# Altium schematic sheet Power.SchDoc
size A3; SheetNumber: 2; SheetTotal: 3
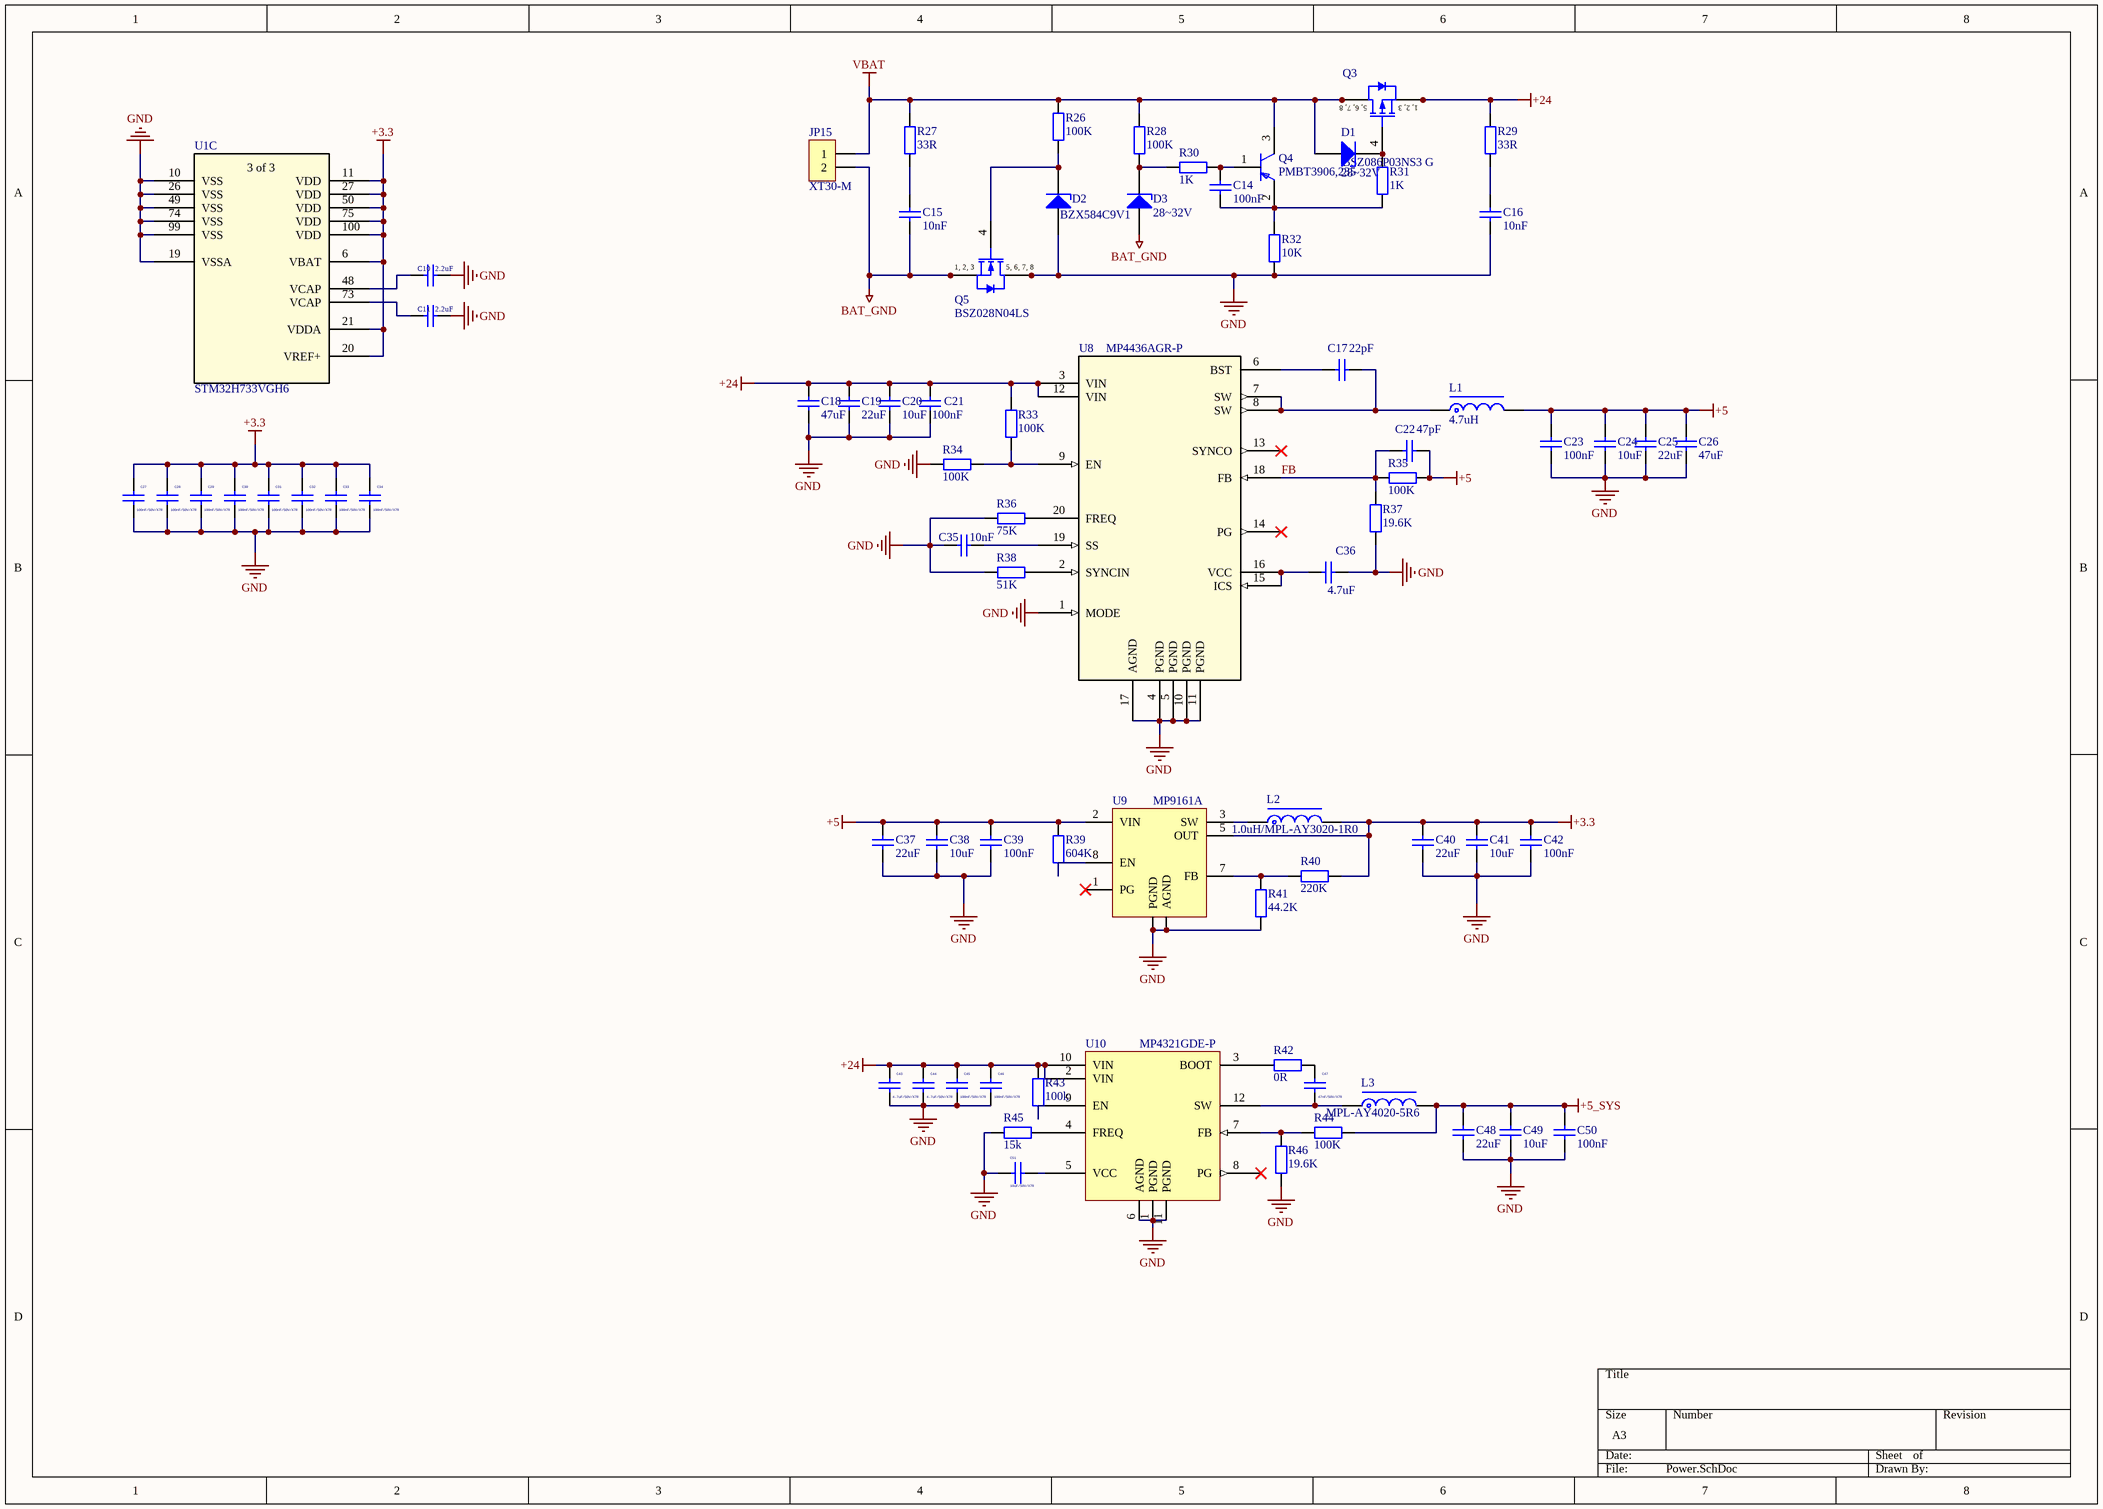
[diagram p0: Power.SchDoc]

## Parts
C10  2.2uF  [C0402_L]
C11  2.2uF  [C0402_L]
C14  100nF  [C0402_M]
C15  10nF  [C0402_M]
C16  10nF  [C0402_M]
C17  22pF  [C0402_M]
C18  47uF  [C1206_L]
C19  22uF  [C0805_L]
C20  10uF  [C0603_L]
C21  100nF  [C0603_L]
C22  47pF  [C0402_M]
C23  100nF  [C0603_L]
C24  10uF  [C0603_L]
C25  22uF  [C0805_L]
C26  47uF  [C1206_L]
C27  100nF/50V/X7R  [C0402_L]
C28  100nF/50V/X7R  [C0402_L]
C29  100nF/50V/X7R  [C0402_L]
C30  100nF/50V/X7R  [C0402_L]
C31  100nF/50V/X7R  [C0402_L]
C32  100nF/50V/X7R  [C0402_L]
C33  100nF/50V/X7R  [C0402_L]
C34  100nF/50V/X7R  [C0402_L]
C35  10nF  [C0402_M]
C36  4.7uF  [C0402_M]
C37  22uF  [C0805_M]
C38  10uF  [C0603_M]
C39  100nF  [C0402_M]
C40  22uF  [C0603_M]
C41  10uF  [C0402_M]
C42  100nF  [C0402_M]
C43  4.7uF/50V/X7R  [C0402_L]
C44  4.7uF/50V/X7R  [C0402_L]
C45  100nF/50V/X7R  [C0402_L]
C46  100nF/50V/X7R  [C0402_L]
C47  47nF/50V/X7R  [C0402_L]
C48  22uF  [C0603_M]
C49  10uF  [C0402_M]
C50  100nF  [C0402_M]
C51  10uF/50V/X7R  [C0402_L]
D1  28~32V  [SOD-523]
D2  BZX584C9V1  [SOD-523]
D3  28~32V  [SOD-523]
JP15  XT30-M  [XT30PW-M]
L1  4.7uH  [MPL-AL6050]
L2  1.0uH/MPL-AY3020-1R0  [MPL-AY3020]
L3  MPL-AY4020-5R6  [MPL-AY4020]
Q3  BSZ086P03NS3 G  [INF-PG-TSDSON-8-1_V]
Q4  PMBT3906,235  [FP-SOT23-IPC_C]
Q5  BSZ028N04LS  [INF-PG-TSDSON-8_FL_V]
R26  100K  [R0402_M]
R27  33R  [R0402_M]
R28  100K  [R0402_M]
R29  33R  [R0402_M]
R30  1K  [R0402_M]
R31  1K  [R0402_M]
R32  10K  [R0402_M]
R33  100K  [R0402_M]
R34  100K  [R0402_M]
R35  100K  [R0402_M]
R36  75K  [R0402_M]
R37  19.6K  [R0402_M]
R38  51K  [R0402_M]
R39  604K  [R0402_L]
R40  220K  [R0402_L]
R41  44.2K  [R0402_L]
R42  0R  [R0402_L]
R43  100k  [R0402_L]
R44  100K  [R0402_L]
R45  15k  [R0402_L]
R46  19.6K  [R0402_L]
U1  STM32H733VGH6  [LQFP100_STM]  (part C of 3)
U8  MP4436AGR-P  [QFN-20_4MMX4MM_MPS]
U9  MP9161A  [SOT23-8]
U10  MP4321GDE-P  [QFN-12_MP4321_MNP]

## Nets
+3.3: C27.2 C28.2 C29.2 C30.2 C31.2 C32.2 C33.2 C34.2 C40.2 C41.2 C42.2 L2.2 R40.2 U1.6(VBAT) U1.11(VDD) U1.20(VREF+) U1.21(VDDA) U1.27(VDD) U1.50(VDD) U1.75(VDD) U1.100(VDD) U9.5(OUT)
+5: C22.2 C23.2 C24.2 C25.2 C26.1 C37.2 C38.2 C39.2 L1.2 R35.2 R39.2 U9.2(VIN)
+5_SYS: C48.2 C49.2 C50.2 L3.2 R44.1
+24: C18.1 C19.1 C20.1 C21.1 C43.2 C44.2 C45.2 C46.2 Q3.1(SOURCE) Q3.2(SOURCE) Q3.3(SOURCE) R29.1 R33.2 R43.2 U8.3(VIN) U8.12(VIN) U10.2(VIN) U10.10(VIN)
BAT_GND: C15.2 D3.1(A) JP15.2 Q5.1(SOURCE) Q5.2(SOURCE) Q5.3(SOURCE)
GND: C10.2 C11.2 C16.2 C18.2 C19.2 C20.2 C21.2 C23.1 C24.1 C25.1 C26.2 C27.1 C28.1 C29.1 C30.1 C31.1 C32.1 C33.1 C34.1 C35.1 C36.1 C37.1 C38.1 C39.1 C40.1 C41.1 C42.1 C43.1 C44.1 C45.1 C46.1 C48.1 C49.1 C50.1 C51.2 D2.1(A) Q5.5(DRAIN) Q5.6(DRAIN) Q5.7(DRAIN) Q5.8(DRAIN) R32.2 R34.2 R36.2 R37.1 R38.2 R41.2 R45.2 R46.2 U1.10(VSS) U1.19(VSSA) U1.26(VSS) U1.49(VSS) U1.74(VSS) U1.99(VSS) U8.1(MODE) U8.4(PGND) U8.5(PGND) U8.10(PGND) U8.11(PGND) U8.17(AGND) U9.4(PGND) U9.6(AGND) U10.1(PGND) U10.6(AGND) U10.11(PGND)
VBAT: D1.1(A) JP15.1 Q3.5(DRAIN) Q3.6(DRAIN) Q3.7(DRAIN) Q3.8(DRAIN) Q4.3(C) R26.2 R27.2 R28.2
FB: C22.1 R35.1 R37.2 U8.18(FB)
NetC10_1: C10.1 U1.48(VCAP)
NetC11_1: C11.1 U1.73(VCAP)
NetC14_1: C14.1 Q4.1(B) R30.1
NetC14_2: C14.2 Q4.2(E) R31.2 R32.1
NetC15_1: C15.1 R27.1
NetC16_1: C16.1 R29.2
NetC17_1: C17.1 U8.6(BST)
NetC17_2: C17.2 L1.1 U8.7(SW) U8.8(SW)
NetC35_2: C35.2 U8.19(SS)
NetC36_2: C36.2 U8.15(ICS) U8.16(VCC)
NetC47_1: C47.1 L3.1 U10.12(SW)
NetC47_2: C47.2 R42.1
NetC51_1: C51.1 U10.5(VCC)
NetD1_2: D1.2(K) Q3.4(GATE) R31.1
NetD2_2: D2.2(K) Q5.4(GATE) R26.1
NetD3_2: D3.2(K) R28.1 R30.2
NetL2_1: L2.1 U9.3(SW)
NetR33_1: R33.1 R34.1 U8.9(EN)
NetR36_1: R36.1 U8.20(FREQ)
NetR38_1: R38.1 U8.2(SYNCIN)
NetR39_1: R39.1 U9.8(EN)
NetR40_1: R40.1 R41.1 U9.7(FB)
NetR42_2: R42.2 U10.3(BOOT)
NetR43_1: R43.1 U10.9(EN)
NetR44_2: R44.2 R46.1 U10.7(FB)
NetR45_1: R45.1 U10.4(FREQ)

Not connected (* = marked no-connect by the designer): U8 13(SYNCO)* 14(PG)*; U9 1(PG)*; U10 8(PG)*

## Notes on the sheet
- (in symbol CMP-00027-1, part C) 3 of 3
- (in symbol CMP-1091-00292-1) 1, 2, 3; 5, 6, 7, 8
- (in symbol CMP-1099-00063-1) 5, 6, 7, 8; 1, 2, 3

## Library data of the parts
C10 C11 C18-C21 C23-C51 = C: 贴片电容/MLCC电容; BOM名称: 无极性贴片电容; 当前库版本V2023.5.31 @淘宝卖家:黄晶宝石: 最新版本发布https://item.taobao.com/item.htm?id=566775463719
C14-C17 C22 = CMP-002-000000-1: 贴片电容/MLCC电容; BOM名称: 无极性贴片电容; 当前库版本V2023.5.31 @淘宝卖家:黄晶宝石: 最新版本发布https://item.taobao.com/item.htm?id=566775463719; Design Item ID: C; Source: 0.1 - 电阻-电容-电感-保险丝-晶振-晶体-磁珠-电位器-法拉电容-馈通电容.SchLib
D1-D3 = 稳压二极管: Zener Diode; 当前库版本V2023.5.31 @淘宝卖家:黄晶宝石: 最新版本发布https://shop463601444.taobao.com
JP15 = XT30-M: XT30公头; 当前库版本V2023.5.31 @淘宝卖家:黄晶宝石: 最新版本发布https://shop463601444.taobao.com
L1-L3 = L-Molding Choke: 一体成型电感; 当前库版本V2023.5.31 @淘宝卖家:黄晶宝石: 最新版本发布https://item.taobao.com/item.htm?id=566775463719; BOM名称: 一体成型电感
Q3 = CMP-1099-00063-1: P-Channel OptiMOS P3 Power-Transistor, -30 V VDS, -40 A ID, -55 to 150 degC, PG-TSDSON-8-1, Reel, Green; Manufacturer: Infineon; RDS (on) (max): 8.6Â mOhm; Rth: 1.8Â K/W; QG: 43.2Â nC; VGS(th) (max): -1.9Â V; RthJC (max): 1.8 K/W; Green: TRUE; Pto t (max): 69Â W; ID (max): -40Â A; IDpuls (max): -160Â A; VDS (max): -30Â V; VGS(th) (min): -3.1Â V; ComponentLink1URL: http://www.infineon.com/; ComponentLink2URL: http://www.infineon.com/dgdl/BSZ086P03NS3+G_2.03.pdf?folderId=db3a304314dca38901154a7313d21a66&fileId=db3a30431ff9881501203d3a5e7d17a9; Mounting Technology: Surface Mount; PartNumber: BSZ086P03NS3 G; Packing: Reel; PackageVersion: Rev. 02, 09/2008; Halogen-free: TRUE; ComponentLink3URL: http://www.infineon.com/dgdl/BSZ240N12NS3+Rev2.0.pdf?folderId=db3a304313b8b5a60113cee8763b02d7&fileId=db3a30432a40a650012a42f3057a0038; PackageDescription: 8-Pin Plastic (Green) Thin Dual Small Outline Non-Leaded Package, 3.3 x 3.3 mm Body, 0.65 mm Pitch; PackageReference: PG-TSDSON-8-1; DatasheetVersion: Rev. 2.03; ComponentLink2Description: Datasheet; ComponentLink3Description: Package Specification; ComponentLink1Description: Manufacturer URL
Q4 = CMP-14406-000050-1: TRANS PNP 40V 200MA TO236AB; RoHS Compliant: Yes
Q5 = CMP-1091-00292-1: N-Channel OptiMOS(TM) Power-MOSFET, 40 V VDS, 40 A ID, -55 to 150 degC, PG-TSDSON-8, Reel, Green; Manufacturer: Infineon; RDS (on) (max) (@4.5V): 3.8Â mOhm; VGS(th) (min): 1.2Â V; IDpuls (max): 160Â A; VDS (max): 40Â V; RthJC (max): 2Â K/W; ID (max): 40Â A; VGS(th) (max): 2Â V; Polarity: N; RDS (on) (max): 2.8Â mOhm; RthJA (max): 60Â K/W; Ptot (max): 63Â W; QG: 32 nc; Green: TRUE; ComponentLink2URL: http://www.infineon.com/dgdl/BSZ028N04LS_rev2.0.pdf?folderId=db3a304313b8b5a60113cee8763b02d7&fileId=db3a304342371bb001424bb10c8b6fff; Mounting Technology: Surface Mount; ComponentLink3URL: http://www.infineon.com/dgdl/BSZ034N04LS_rev2.0.pdf?folderId=db3a304313b8b5a60113cee8763b02d7&fileId=db3a304342371bb001424c3fe5bc7083; PackageDescription: 8-Pin Plastic (Green) Thin Dual Small Outline Non-Leaded Package, 3.3 x 3.3 mm Body, 0.65 mm Pitch; ComponentLink2Description: Datasheet; ComponentLink1Description: Manufacturer URL; Packing: Reel; DatasheetVersion: Rev. 2.0; ComponentLink1URL: http://www.infineon.com/; Halogen-free: TRUE; Mounting: SMD; Technology: OptiMOS(TM); PackageVersion: Rev. 2.0, 04/2013; PartNumber: BSZ028N04LS; ComponentLink3Description: Package Specification; PackageReference: PG-TSDSON-8
R26-R38 = CMP-005-000000-1: 贴片电阻; 联系下单店铺卖家 免费帮你查找封装: 联系下单店铺卖家 免费技术支持; BOM名称: 贴片电阻; Source: 0.1 - 电阻-电容-电感-保险丝-晶振-晶体-磁珠-电位器-法拉电容-馈通电容.SchLib; Design Item ID: R
R39-R46 = CMP-005-000000-2: 贴片电阻0; 联系下单店铺卖家 免费帮你查找封装: 联系下单店铺卖家 免费技术支持; BOM名称: 贴片电阻; Source: 0.1 - 电阻-电容-电感-保险丝-晶振-晶体-磁珠-电位器-法拉电容-馈通电容.SchLib; Design Item ID: R
U1 = CMP-00027-1: High-performance and DSP with DP-FPU, Arm Cortex-M7 MCU with 1 MByte Flash, 564 Kbytes RAM, 550 MHz CPU, L1 cache,...
U8 = CMP-00030-2: QFN 20/ Synchronous Step-Down Converter 45V, 6A, Low Iq
U9 = CMP-00064-1
U10 = CMP-00070-1: Voltage Regulator, DC/DC Gate Driver, 3.3 V to 36 V in, 0..8V to 34.2 V/1A Out, 2.42 MHz, QFN-12